# EAGLE design caram2-mrf-spi-r1 (EAGLE 6.5.0)
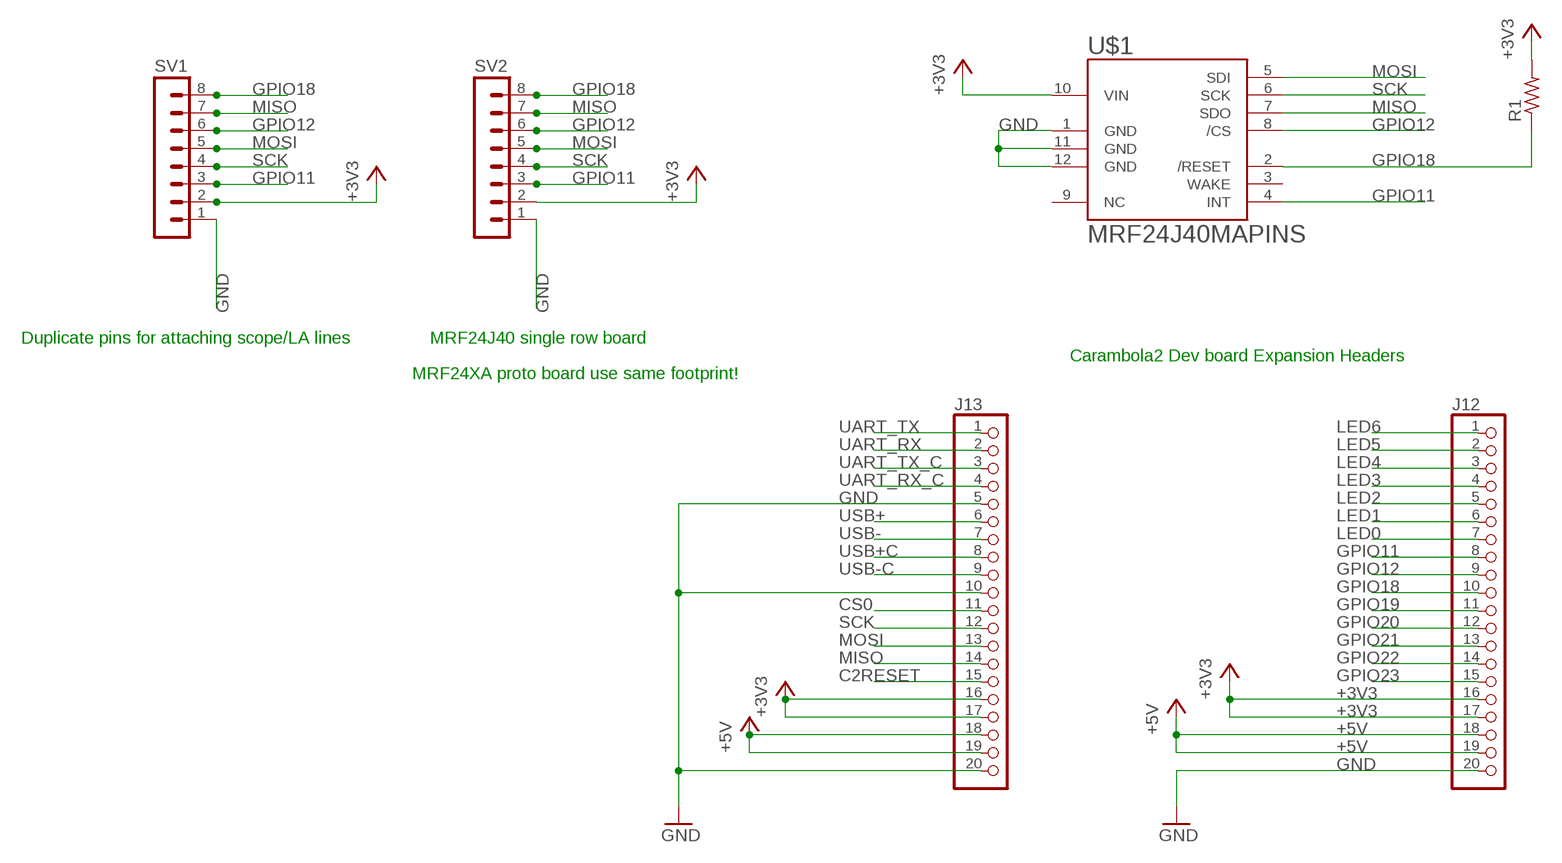
[diagram p0: schematic, sheet 1]

## Parts
J12  PINHD-1X20  [1X20]
J13  PINHD-1X20  [1X20]
R1  R-US_R0805  [R0805]
SV1  MA08-1  [MA08-1]
SV2  MA08-1  [MA08-1]
U$1  MRF24J40MAPINS  [MRF24J40MA]

## Nets
+3V3: J12.16 J12.17 J13.16 J13.17 R1.2 SV1.2 SV2.2 U$1.10(VIN)
+5V: J12.18 J12.19 J13.18 J13.19
C2RESET: J13.15
CS0: J13.11
GND: J12.20 J13.5 J13.10 J13.20 SV1.1 SV2.1 U$1.1(GND) U$1.11(GND) U$1.12(GND)
GPIO11: J12.8 SV1.3 SV2.3 U$1.4(INT)
GPIO12: J12.9 SV1.6 SV2.6 U$1.8(/CS)
GPIO18: J12.10 R1.1 SV1.8 SV2.8 U$1.2(/RESET)
GPIO19: J12.11
GPIO20: J12.12
GPIO21: J12.13
GPIO22: J12.14
GPIO23: J12.15
LED0: J12.7
LED1: J12.6
LED2: J12.5
LED3: J12.4
LED4: J12.3
LED5: J12.2
LED6: J12.1
MISO: J13.14 SV1.7 SV2.7 U$1.7(SDO)
MOSI: J13.13 SV1.5 SV2.5 U$1.5(SDI)
SCK: J13.12 SV1.4 SV2.4 U$1.6(SCK)
UART_RX: J13.2
UART_RX_C: J13.4
UART_TX: J13.1
UART_TX_C: J13.3
USB+: J13.6
USB+C: J13.8
USB-: J13.7
USB-C: J13.9
Unconnected: U$1.3(WAKE) U$1.9(NC)

## Notes on the sheet
- Duplicate pins for attaching scope/LA lines | MRF24J40 single row board
- Carambola2 Dev board Expansion Headers
- MRF24XA proto board use same footprint!

## Library data of the parts
J12 J13 = pinhead:PINHD-1X20: PIN HEADER
R1 = rcl:R-US_: RESISTOR, American symbol
SV1 SV2 = con-lstb:MA08-1: PIN HEADER; OC_FARNELL: unknown; OC_NEWARK: unknown
U$1 = karlnet-parts:MRF24J40MA: MRF24J40MA module, 802.15.4 from microchip.

## Board
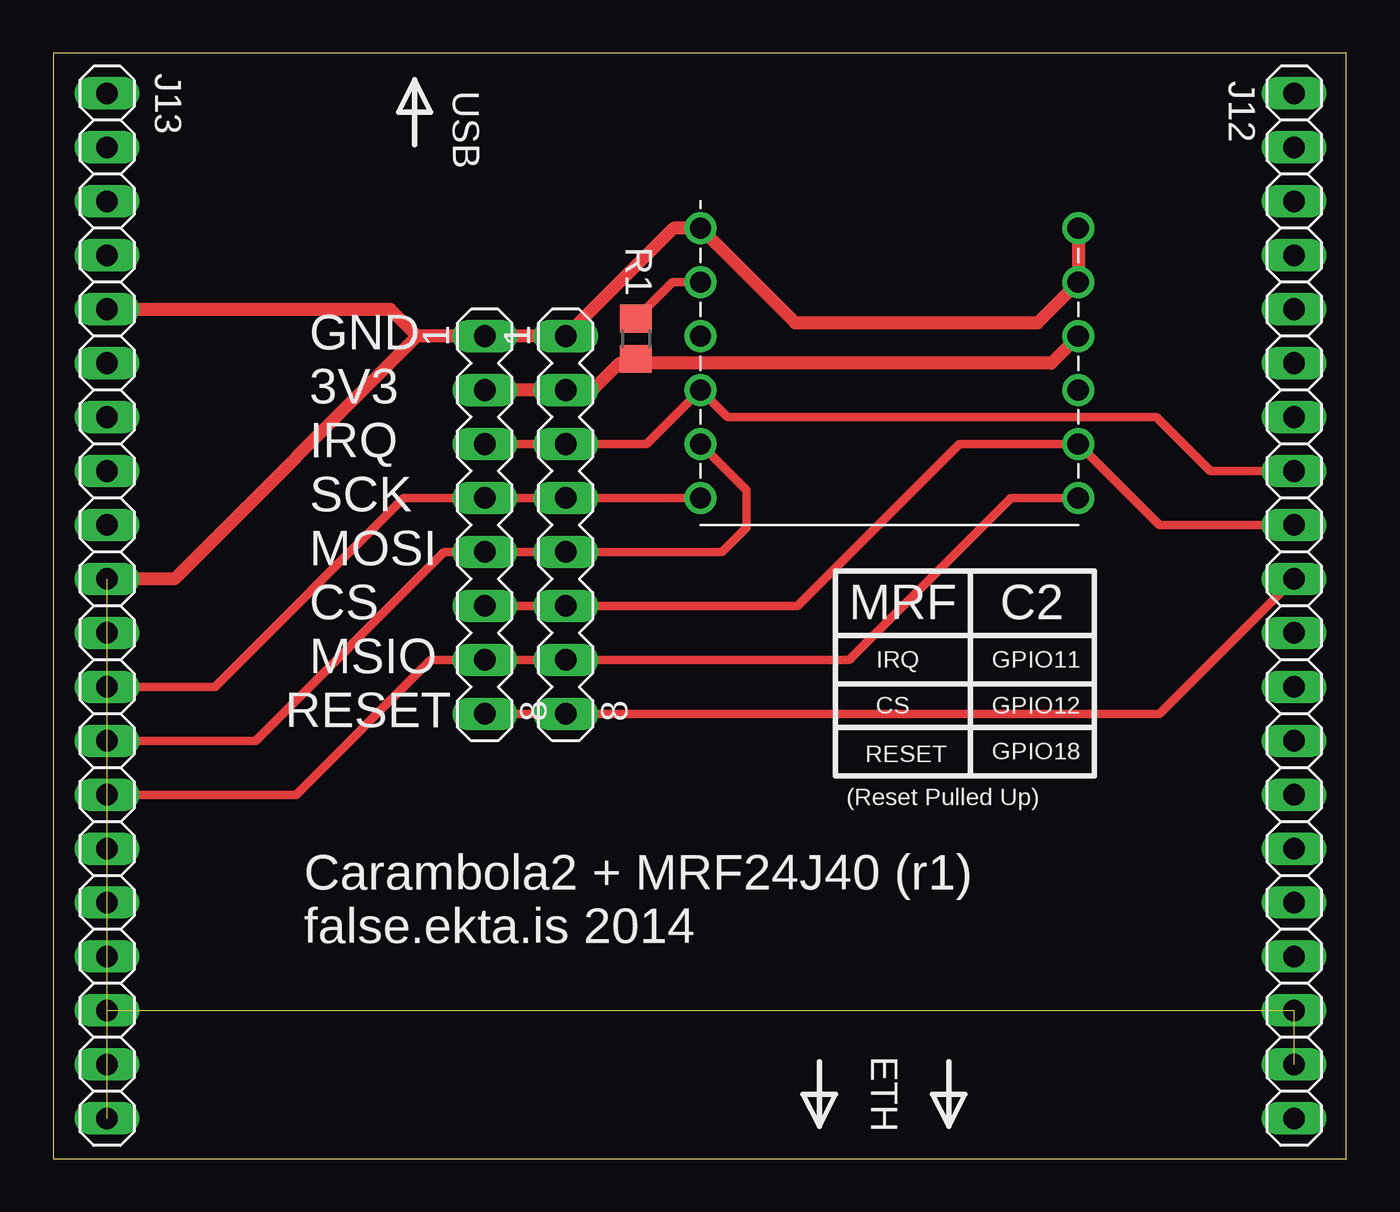
[diagram p1: board, top side]
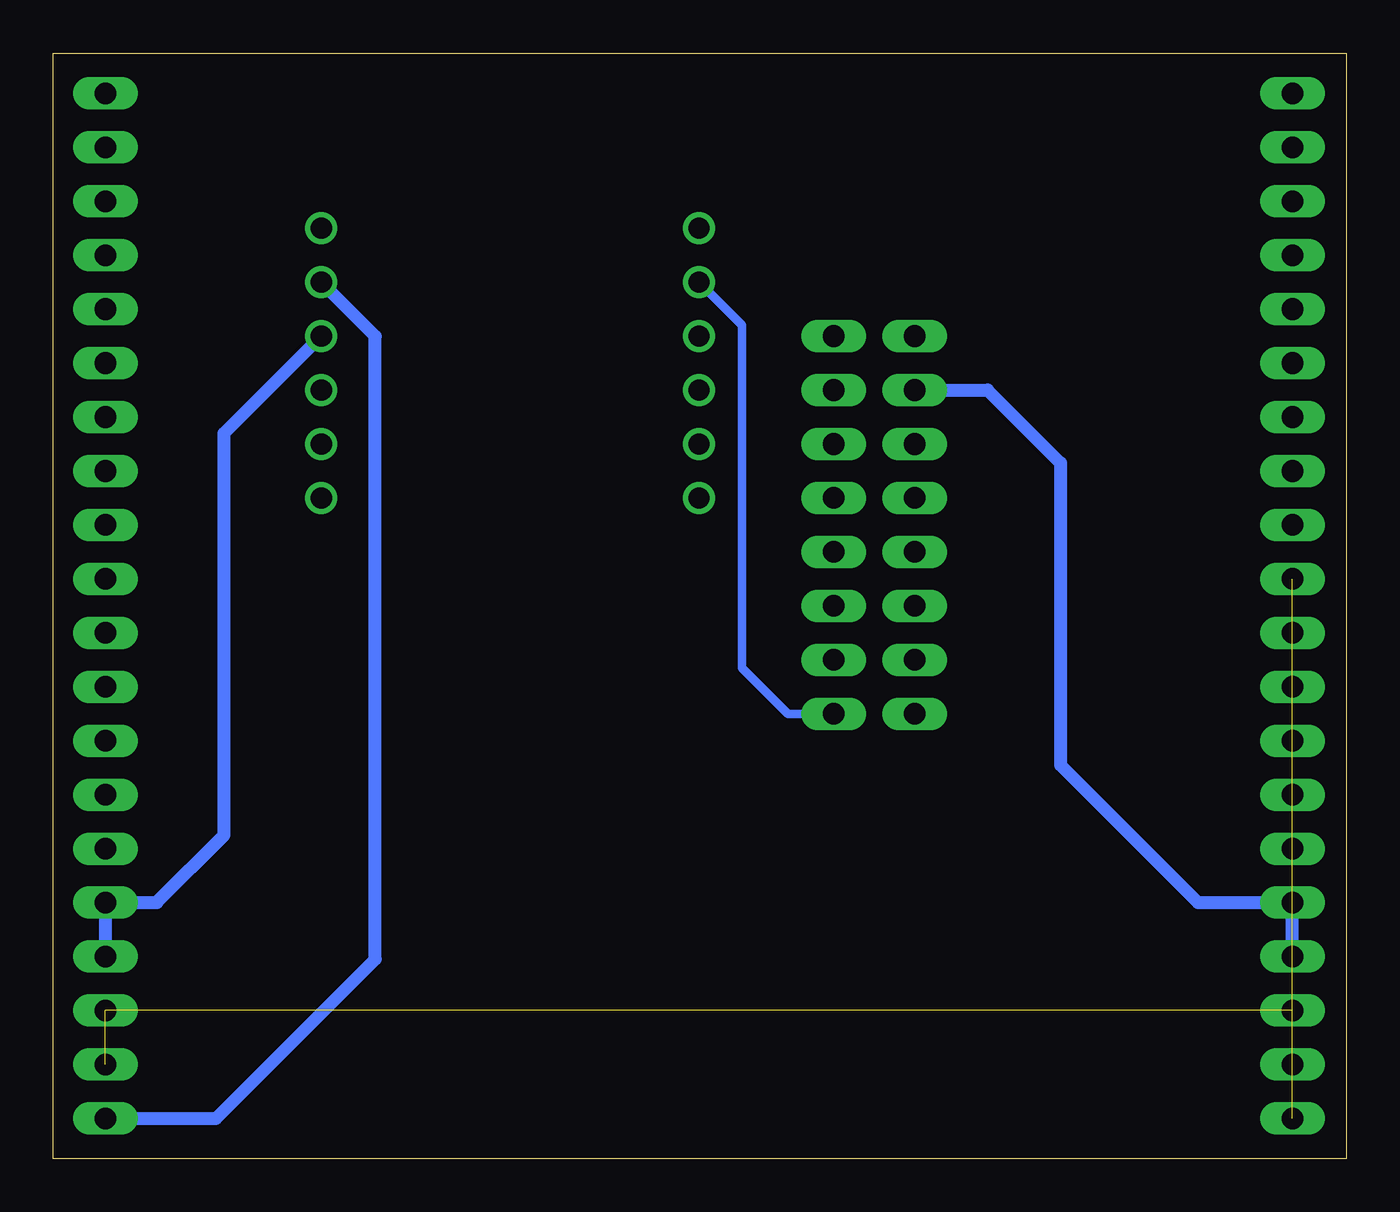
[diagram p2: board, bottom side, seen from below]

Size 60.88 x 52.06 mm. Coordinates in mm from the lower left corner, seen from the top.
Outline: 0,0 60.88,0 60.88,52.06 0,52.06 0,0
Copper layers (1*16): Top 0.035mm / dielectric 1.5mm / Bottom 0.035mm
Design rules "ITEADstudio_DRC": minimum track width 6mil, minimum drill 12mil, track to track 6mil, track to pad 6mil, pad to pad 6mil, via to via 6mil, smd to smd 0mil, copper to edge 10mil, drill to drill 10mil, minimum pad ring 10mil, minimum via ring 6mil, stop-mask expansion 2mil, vias tented up to drill 100mil, thermal gap 10mil

### Footprints (pad centres in the part's own frame; a part is rotated, then mirrored left to right if it is on the bottom)
1X20 = drill 1.016 long: 1 -24.13,0; 2 -21.59,0; 3 -19.05,0; 4 -16.51,0; 5 -13.97,0; 6 -11.43,0; 7 -8.89,0; 8 -6.35,0; 9 -3.81,0; 10 -1.27,0; 11 1.27,0; 12 3.81,0; 13 6.35,0; 14 8.89,0; 15 11.43,0; 16 13.97,0; 17 16.51,0; 18 19.05,0; 19 21.59,0; 20 24.13,0
R0805 = smd 1.3 x 1.5: 1 -0.95,0; 2 0.95,0
MA08-1 = drill 1.016 long: 1 -8.89,0; 2 -6.35,0; 3 -3.81,0; 4 -1.27,0; 5 1.27,0; 6 3.81,0; 7 6.35,0; 8 8.89,0
MRF24J40MA = drill 1: 1 -8.89,12.7; 2 -8.89,10.16; 3 -8.89,7.62; 4 -8.89,5.08; 5 -8.89,2.54; 6 -8.89,0; 7 8.89,0; 8 8.89,2.54; 9 8.89,5.08; 10 8.89,7.62; 11 8.89,10.16; 12 8.89,12.7

### Placement (x,y rotation side)
J12  58.42,26.04 270 top
J13  2.54,26.04 270 top
R1  27.43,38.61 270 top
SV1  24.13,29.84 270 top
SV2  20.32,29.84 270 top
U$1  39.37,31.11 0 top

### Tracks (layer width: path | path; a pad name or v marks a point on that pad's centre or on a via)
+3V3
  Top 0.406: R1.2 27.43,37.47
  Top 0.61: SV2.2 SV1.2 25.4,36.2 26.67,37.47 27.43,37.47 46.99,37.47 U$1.10
  Bottom 0.61: U$1.10 52.83,34.16 52.83,15.24 56.01,12.06 J12.16 J12.17 | SV2.2 16.89,36.2 13.46,32.77 13.46,18.54 6.99,12.06 J13.16 J13.17
+5V  (3 unrouted)
GND  (1 unrouted)
  Top 0.61: U$1.12 U$1.11 46.35,39.37 34.92,39.37 U$1.1 29.21,43.81 SV1.1 SV2.1 17.14,38.73 | 17.14,38.73 5.71,27.3 J13.10 | J13.5 15.88,40.01 17.14,38.73
  Bottom 0.61: U$1.11 45.72,38.73 45.72,9.4 53.21,1.91 J12.20
GPIO11
  Top 0.406: J12.8 54.48,32.38 51.94,34.92 31.75,34.92 U$1.4 27.94,33.66 SV1.3 SV2.3
GPIO12
  Top 0.406: J12.9 52.07,29.84 U$1.8 42.67,33.66 35.05,26.04 SV1.6 SV2.6
GPIO18
  Top 0.406: U$1.2 29.15,41.27 R1.1 | J12.10 52.07,20.95 SV1.8 SV2.8
  Bottom 0.406: U$1.2 28.45,39.24 28.45,23.11 26.29,20.95 SV1.8
MISO
  Top 0.406: U$1.7 45.09,31.11 37.47,23.5 SV1.7 SV2.7 17.78,23.5 11.43,17.14 J13.14
MOSI
  Top 0.406: U$1.5 32.64,31.5 32.64,29.72 31.5,28.57 SV1.5 SV2.5 18.41,28.57 9.53,19.68 J13.13
SCK
  Top 0.406: U$1.6 SV1.4 SV2.4 16.51,31.11 7.62,22.23 J13.12

### Text on the board
tPlace: USB | GND | 3V3 | IRQ | SCK | MOSI | CS | MRF | C2 | MSIO | IRQ | GPIO11 | CS | GPIO12 | RESET | RESET | GPIO18 | (Reset Pulled Up) | Carambola2 + MRF24J40 (r1) / false.ekta.is 2014 | ETH